# Altium schematic sheet 002-MCU.SchDoc
size A4; SheetNumber: 5; SheetTotal: 5
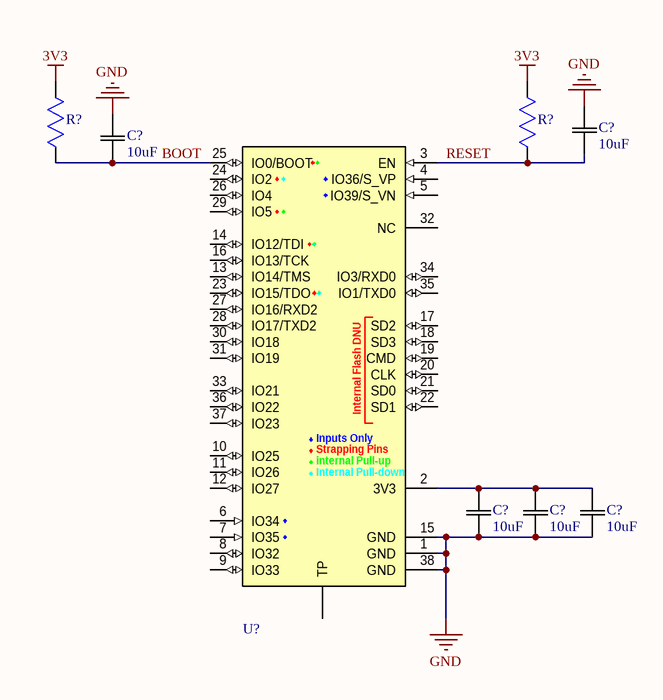
[diagram p0: 002-MCU.SchDoc]

## Parts
(Parts that share a designator on the sheet are numbered #1, #2 ... from top to bottom, then left to right.)
C?#1  10uF  [CAP 0603/1608]
C?#2  10uF  [CAP 0603/1608]
C?#3  10uF  [CAP 0603/1608]
C?#4  10uF  [CAP 0603/1608]
C?#5  10uF  [CAP 0603/1608]
R?#1  CRCW06031K00FKEA  [CAP 0603/1608]  (value not drawn)
R?#2  CRCW06031K00FKEA  [CAP 0603/1608]  (value not drawn)
U?  Red markers can't be pull up. Blue markers can't be pull down.  [ESP32­WROOM­32E_EXP]  (value not drawn)

## Nets
3V3: R?#1.2 R?#2.2
GND: C?#1.2 C?#2.2 C?#3.1 C?#4.1 C?#5.1 U?.1(GND) U?.15(GND) U?.38(GND)
BOOT: C?#2.1 R?#1.1 U?.25(IO0/BOOT)
RESET: C?#1.1 R?#2.1 U?.3(EN)
NetC?#3_2: C?#3.2 C?#4.2 C?#5.2 U?.2(3V3)

Not connected (* = marked no-connect by the designer): U? 4(IO36/S_VP) 5(IO39/S_VN) 6(IO34) 7(IO35) 8(IO32) 9(IO33) 10(IO25) 11(IO26) 12(IO27) 13(IO14/TMS) 14(IO12/TDI) 16(IO13/TCK) 17(SD2) 18(SD3) 19(CMD) 20(CLK) 21(SD0) 22(SD1) 23(IO15/TDO) 24(IO2) 26(IO4) 27(IO16/RXD2) 28(IO17/TXD2) 29(IO5) 30(IO18) 31(IO19) 32(NC) 33(IO21) 34(IO3/RXD0) 35(IO1/TXD0) 36(IO22) 37(IO23) TP

## Notes on the sheet
- (in symbol ESP-WROOM-32) Internal Flash DNU; Inputs Only; Strapping Pins; internal Pull-up; Internal Pull-down

## Library data of the parts
C?#1-C?#5 = CL10A106KQ8NNNC: CAP 10uF Ceramic 0603 capacitor; Mfr_Name: Samsung
R?#1 R?#2 = CRCW06031K00FKEA: D11/CRCW0603 100 1K 1% ET1 e3; Manufacturer_Name: Vishay; Copyright: Copyright (C) 2025 Ultra Librarian. All rights reserved.; Manufacturer_Part_Number: CRCW06031K00FKEA; Datasheet: https://www.vishay.com/doc?20035
U? = ESP-WROOM-32: ESP32 MCU